# EAGLE design z1-cc1120 (EAGLE 6.5.0)
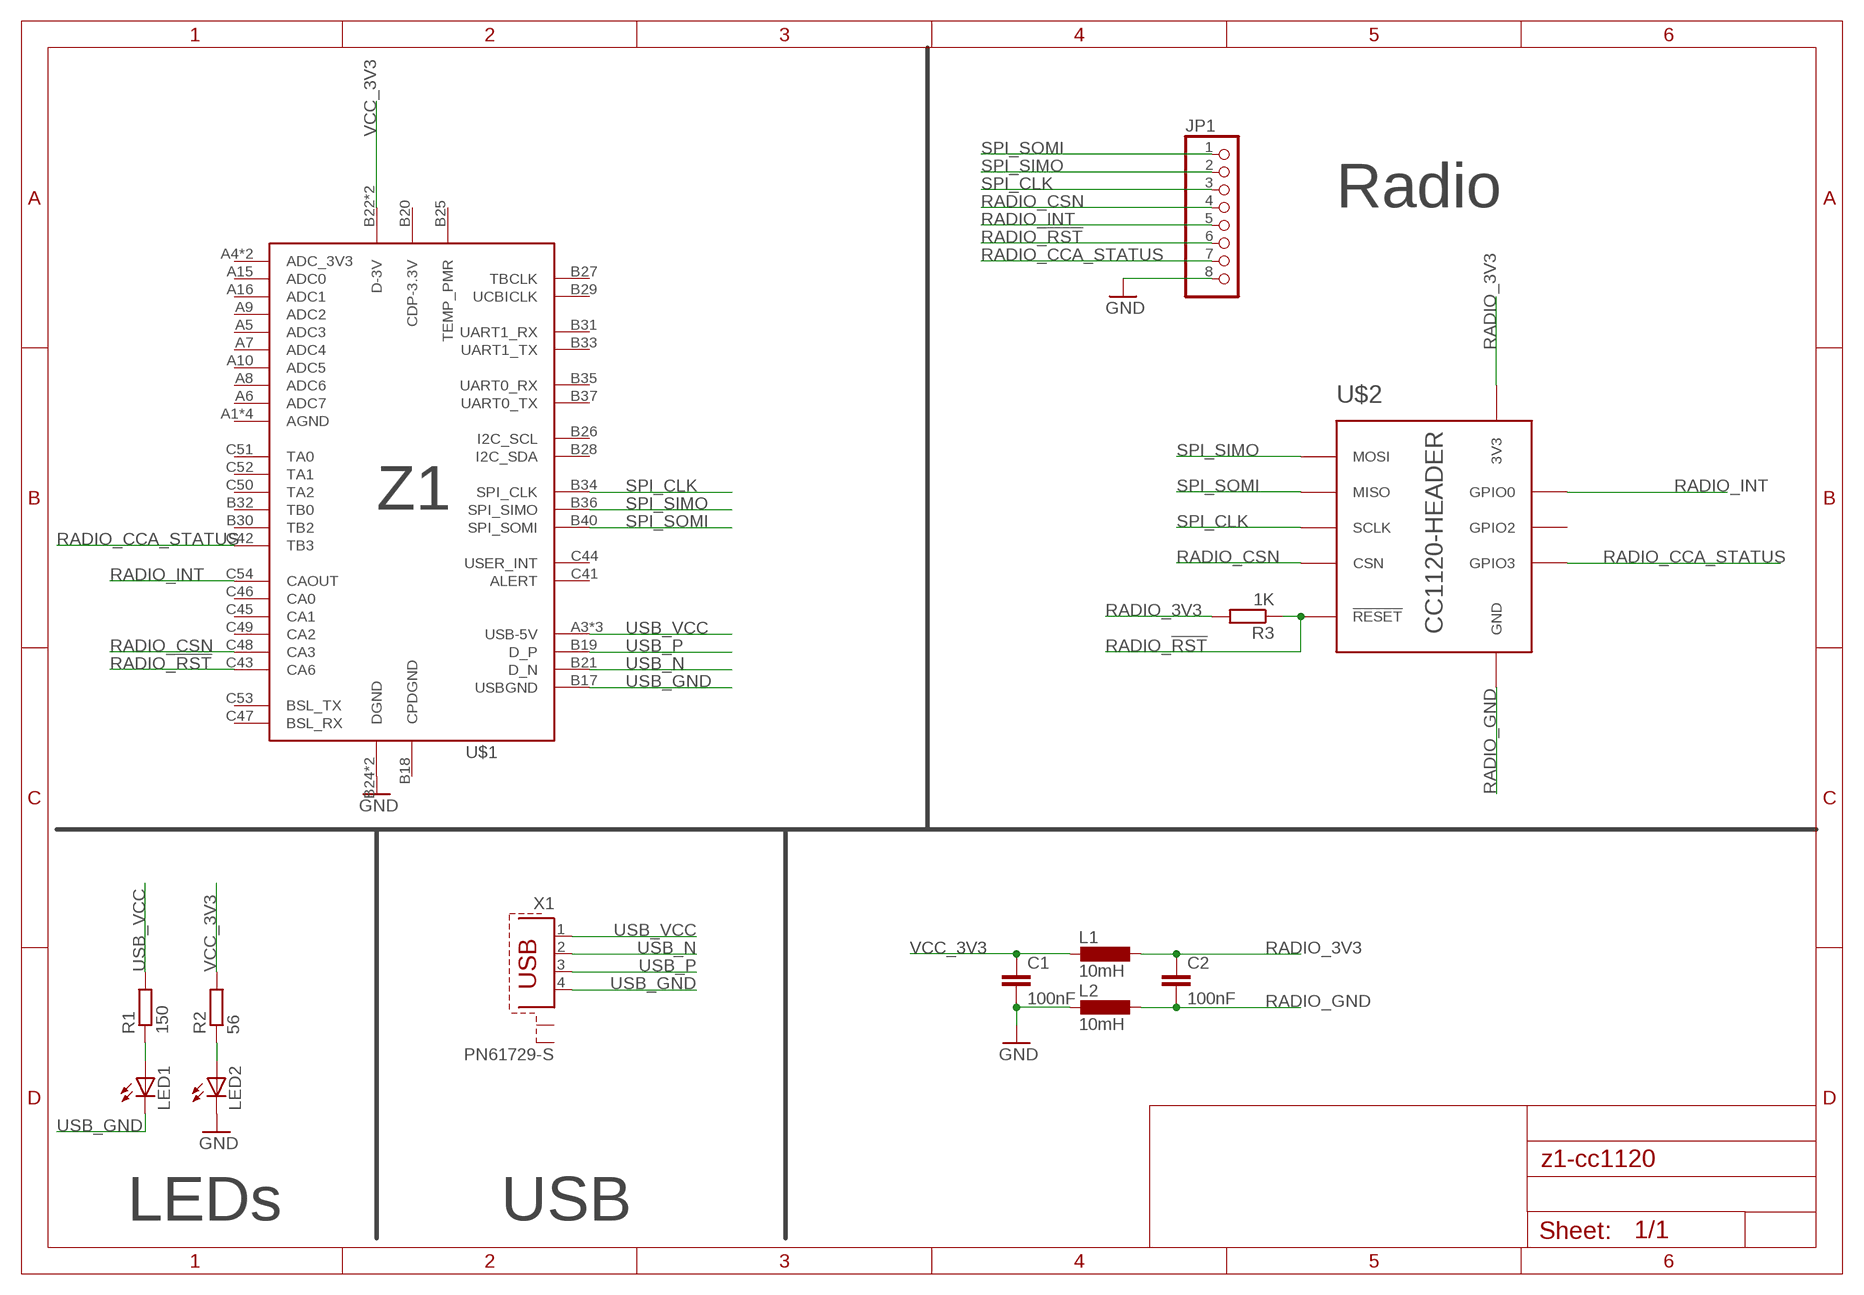
[diagram p0: schematic, sheet 1]

## Parts
C1  100nF  C-EUC0805  [C0805]
C2  100nF  C-EUC0805  [C0805]
JP1  PINHD-1X8  [1X08]
L1  10mH  L-EUL3230M  [L3230M]
L2  10mH  L-EUL3230M  [L3230M]
LED1  LEDCHIP-LED0805  [CHIP-LED0805]
LED2  LEDCHIP-LED0805  [CHIP-LED0805]
R1  150  R-EU_R0805  [R0805]
R2  56  R-EU_R0805  [R0805]
R3  1K  R-EU_R0805  [R0805]
U$1  Z1  [Z1]
U$2  CC1120-HEADER-SMT  [CC1120-HEADERS-SMT]
X1  PN61729-S  [PN61729-S]

## Nets
GND: C1.2 JP1.8 L2.2 LED2.C U$1.B24(DGND) U$1.C39(DGND)
N$24: LED2.A R2.1
N$26: LED1.A R1.1
RADIO_3V3: C2.1 L1.1 R3.2 U$2.3V3-1(3V3) U$2.3V3-2(3V3)
RADIO_!RST: JP1.6 R3.1 U$1.C43(CA6) U$2.RESET(!RESET)
RADIO_CCA_STATUS: JP1.7 U$1.C42(TB3) U$2.GPIO3
RADIO_CSN: JP1.4 U$1.C48(CA3) U$2.CSN
RADIO_GND: C2.2 L2.1 U$2.GND U$2.GND1(GND) U$2.GND2(GND)
RADIO_INT: JP1.5 U$1.C54(CAOUT) U$2.GPIO0
SPI_CLK: JP1.3 U$1.B34(SPI_CLK) U$2.SCLK
SPI_SIMO: JP1.2 U$1.B36(SPI_SIMO) U$2.MOSI
SPI_SOMI: JP1.1 U$1.B40(SPI_SOMI) U$2.MISO
USB_GND: LED1.C U$1.B17(USBGND) X1.4
USB_N [usb]: U$1.B21(D_N) X1.2
USB_P [usb]: U$1.B19(D_P) X1.3
USB_VCC: R1.2 U$1.A3(USB-5V) U$1.A13(USB-5V) U$1.B23(USB-5V) X1.1
VCC_3V3: C1.1 L1.2 R2.2 U$1.B22(D-3V) U$1.C40(D-3V)
Unconnected: U$1.A1(AGND) U$1.A2(AGND) U$1.A5(ADC3) U$1.A6(ADC7) U$1.A7(ADC4) U$1.A8(ADC6) U$1.A9(ADC2) U$1.A10(ADC5) U$1.A11(AGND) U$1.A12(AGND) U$1.A15(ADC0) U$1.A16(ADC1) U$1.B18(CPDGND) U$1.B20(CDP-3.3V) U$1.B25(TEMP_PMR) U$1.B26(I2C_SCL) U$1.B27(TBCLK) U$1.B28(I2C_SDA) U$1.B29(UCBICLK) U$1.B30(TB2) U$1.B31(UART1_RX) U$1.B32(TB0) U$1.B33(UART1_TX) U$1.B35(UART0_RX) U$1.B37(UART0_TX) U$1.C41(ALERT) U$1.C44(USER_INT) U$1.C45(CA1) U$1.C46(CA0) U$1.C47(BSL_RX) U$1.C49(CA2) U$1.C50(TA2) U$1.C51(TA0) U$1.C52(TA1) U$1.C53(BSL_TX) U$2.GPIO2 X1.S1 X1.S2

## Notes on the sheet
- Radio
- LEDs | USB

## Power pins joined to a net without a drawn wire
ADC_3V3: U$1.A4(ADC_3V3) U$1.A14(ADC_3V3)

## Library data of the parts
C1 C2 = resistor:C-EU: CAPACITOR, European symbol
JP1 = pinhead:PINHD-1X8: PIN HEADER
L1 L2 = resistor:L-EU: INDUCTOR, European symbol
LED1 LED2 = led:LED: LED OSRAM: - CHIPLED LG R971, LG N971, LY N971, LG Q971, LY Q971, LO R971, LY R971 LH N974, LH R974 LS Q976, LO Q976, LY Q976 LO Q996 - Hyper CHIPLED LW Q18S LB Q993, LB Q99A, LB R99A - SideLED LS A670, LO A670, LY A670, LG A670, LP A670 LB A673, LV A673, LT A673, LW A673 LH A674 LY A675 LS A676, LA A676, LO A676, LY A676, LW A676 LS A679, LY A679, LG A679 - Hyper Micro SIDELED® LS Y876, LA Y876, LO Y876, LY Y876 LT Y87S - SmartLED LW L88C, LW L88S LB L89C, LB L89S, LG L890 LS L89K, LO L89K, LY L89K LS L896, LA L896, LO L896, LY L896 - TOPLED LS T670, LO T670, LY T670, LG T670, LP T670 LSG T670, LSP T670, LSY T670, LOP T670, LYG T670 LG T671, LOG T671, LSG T671 LB T673, LV T673, LT T673, LW T673 LH T674 LS T676, LA T676, LO T676, LY T676, LB T676, LH T676, LSB T676, LW T676 LB T67C, LV T67C, LT T67C, LS T67K, LO T67K, LY T67K, LW E67C LS E67B, LA E67B, LO E67B, LY E67B, LB E67C, LV E67C, LT E67C LW T67C LS T679, LY T679, LG T679 LS T770, LO T770, LY T770, LG T770, LP T770 LB T773, LV T773, LT T773, LW T773 LH T774 LS E675, LA E675, LY E675, LS T675 LS T776, LA T776, LO T776, LY T776, LB T776 LHGB T686 LT T68C, LB T68C - Hyper Mini TOPLED® LB M676 - Mini TOPLED Santana® LG M470 LS M47K, LO M47K, LY M47K Source: http://www.osram.convergy.de LUXEON: - LUMILED® LXK2-PW12-R00, LXK2-PW12-S00, LXK2-PW14-U00, LXK2-PW14-V00 LXK2-PM12-R00, LXK2-PM12-S00, LXK2-PM14-U00 LXK2-PE12-Q00, LXK2-PE12-R00, LXK2-PE12-S00, LXK2-PE14-T00, LXK2-PE14-U00 LXK2-PB12-K00, LXK2-PB12-L00, LXK2-PB12-M00, LXK2-PB14-N00, LXK2-PB14-P00, LXK2-PB14-Q00 LXK2-PR12-L00, LXK2-PR12-M00, LXK2-PR14-Q00, LXK2-PR14-R00 LXK2-PD12-Q00, LXK2-PD12-R00, LXK2-PD12-S00 LXK2-PH12-R00, LXK2-PH12-S00 LXK2-PL12-P00, LXK2-PL12-Q00, LXK2-PL12-R00 Source: www.luxeon.com KINGBRIGHT: KA-3528ASYC Source: www.kingbright.com
R1-R3 = resistor:R-EU_: RESISTOR, European symbol
U$1 = z1:Z1
U$2 = CC11x:CC1120-HEADER; MANUFACTURER: HARWIN; MPN: M50-3601042; OC_FARNEL: CN14037; QTY: 2
X1 = con-berg:PN61729-S: BERG USB connector; OC_FARNELL: unknown; OC_NEWARK: unknown

## Net classes
1 usb: width 0.305 mm, clearance 0.152 mm

## Board
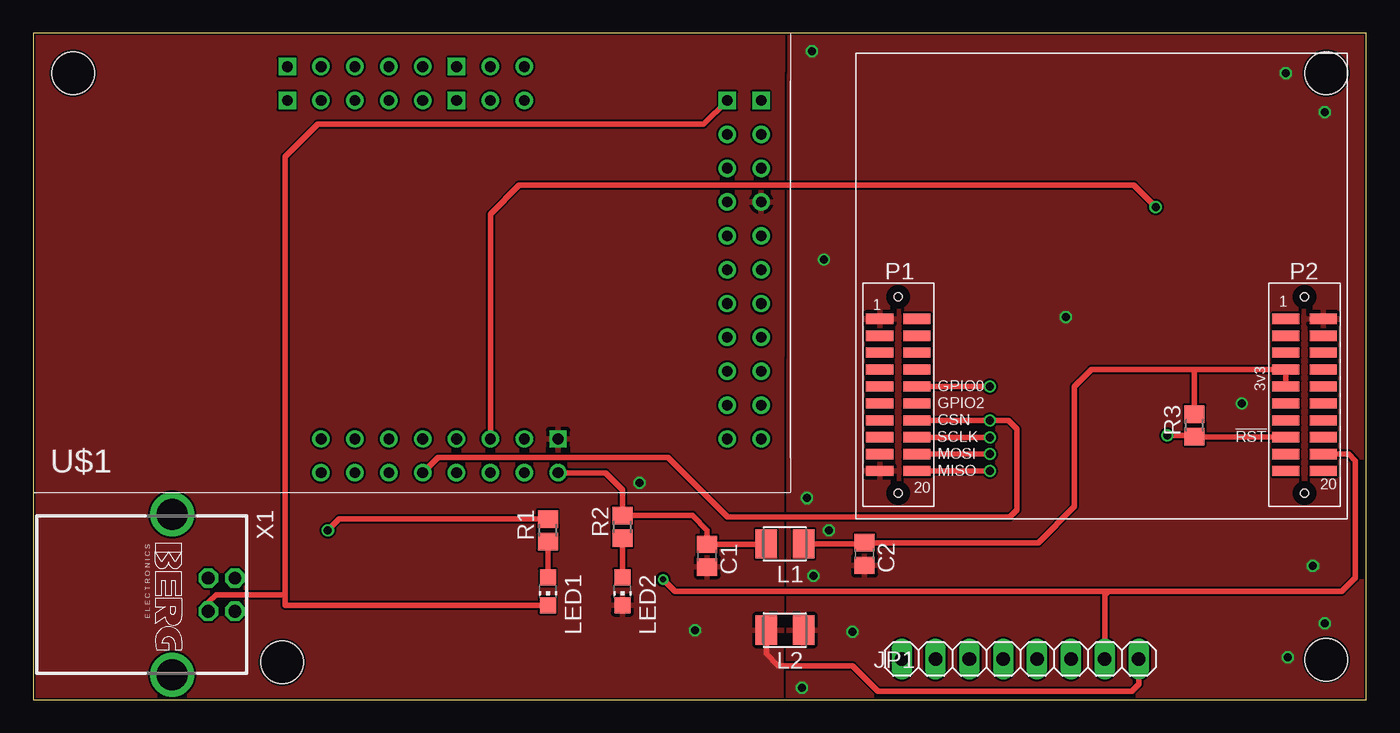
[diagram p1: board, top side]
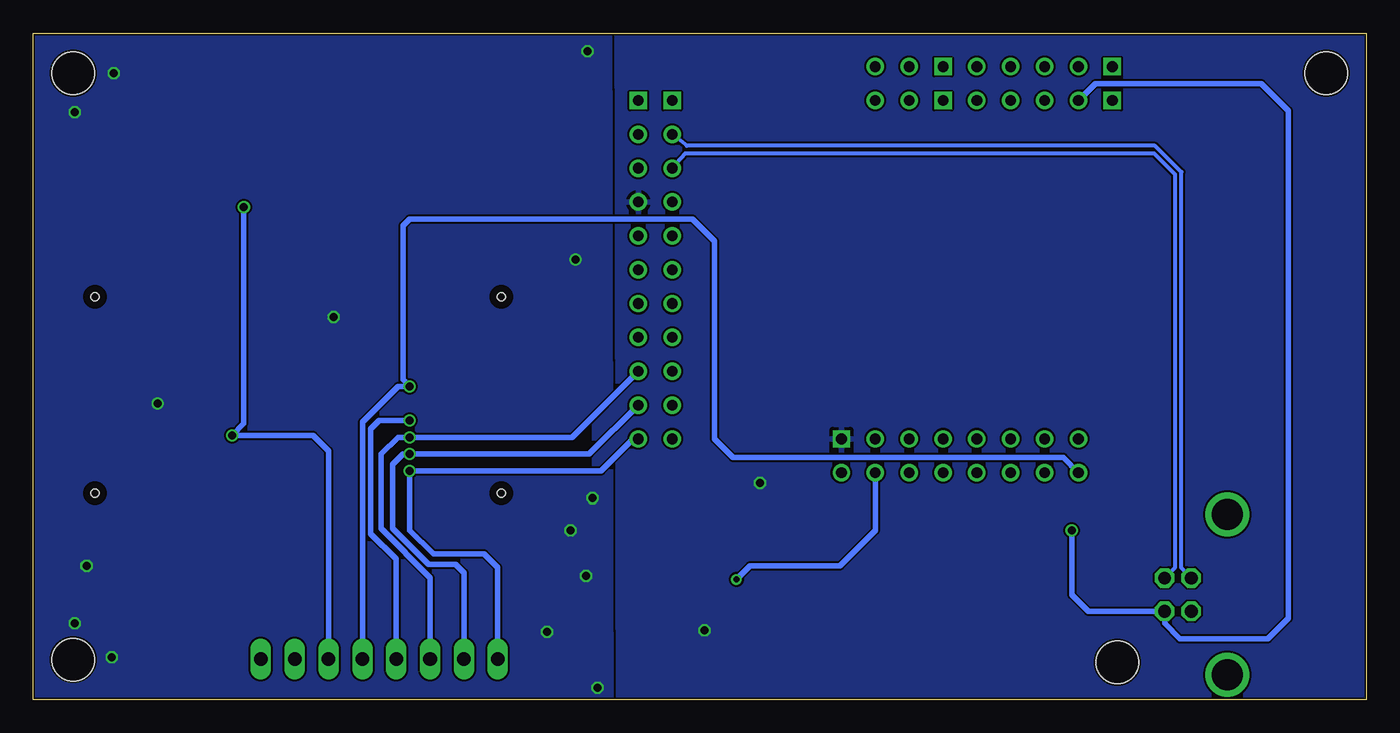
[diagram p2: board, bottom side, seen from below]

Size 100 x 50 mm. Coordinates in mm from the lower left corner, seen from the top.
Outline: 0,0 100,0 100,50 0,50 0,0
Copper layers (1*16): Top 0.035mm / dielectric 1.5mm / Bottom 0.035mm
Design rules "Hackvana *": minimum track width 6mil, minimum drill 0.3mm, track to track 6mil, track to pad 6mil, pad to pad 6mil, via to via 6mil, smd to smd 0mil, copper to edge 6mil, drill to drill 6mil, minimum pad ring 10mil, minimum via ring 6mil, stop-mask expansion 2mil, vias tented up to drill 100mil, thermal gap 10mil
Holes 3.2 mm at 97,3 3,47 97,47 18.67,2.79

### Footprints (pad centres in the part's own frame; a part is rotated, then mirrored left to right if it is on the bottom)
C0805 = smd 1.3 x 1.5: 1 -0.85,0; 2 0.85,0
1X08 = drill 1.016 long: 1 -8.89,0; 2 -6.35,0; 3 -3.81,0; 4 -1.27,0; 5 1.27,0; 6 3.81,0; 7 6.35,0; 8 8.89,0
L3230M = smd 1.6 x 2.2: 1 -1.4,0; 2 1.4,0
CHIP-LED0805 = smd 1.2 x 1.2: A 0,-1.05; C 0,1.05
R0805 = smd 1.3 x 1.5: 1 -0.85,0; 2 0.85,0
Z1 = drill 0.8 square: A1 17.78,-5.08; A2 17.78,-2.54; A11 30.48,-5.08; A12 30.48,-2.54; B17 50.8,-5.08; B18 53.34,-5.08; C39 38.1,-30.48 | drill 0.8: A3 20.32,-5.08; A4 20.32,-2.54; A5 22.86,-5.08; A6 22.86,-2.54; A7 25.4,-5.08; A8 25.4,-2.54; A9 27.94,-5.08; A10 27.94,-2.54; A13 33.02,-5.08; A14 33.02,-2.54; A15 35.56,-5.08; A16 35.56,-2.54; B19 50.8,-7.62; B20 53.34,-7.62; B21 50.8,-10.16; B22 53.34,-10.16; B23 50.8,-12.7; B24 53.34,-12.7; B25 50.8,-15.24; B26 53.34,-15.24; B27 50.8,-17.78; B28 53.34,-17.78; B29 50.8,-20.32; B30 53.34,-20.32; B31 50.8,-22.86; B32 53.34,-22.86; B33 50.8,-25.4; B34 53.34,-25.4; B35 50.8,-27.94; B36 53.34,-27.94; B37 50.8,-30.48; B40 53.34,-30.48; C40 38.1,-33.02; C41 35.56,-30.48; C42 35.56,-33.02; C43 33.02,-30.48; C44 33.02,-33.02; C45 30.48,-30.48; C46 30.48,-33.02; C47 27.94,-30.48; C48 27.94,-33.02; C49 25.4,-30.48; C50 25.4,-33.02; C51 22.86,-30.48; C52 22.86,-33.02; C53 20.32,-30.48; C54 20.32,-33.02
CC1120-HEADERS-SMT = smd 2.032 x 0.762: 3V3-1 13.97,1.905; 3V3-2 13.97,0.635; CSN -13.716,-1.905; GND -16.51,-5.715; GND1 -16.51,5.715; GND2 16.764,5.715; GPIO0 -13.716,0.635; GPIO2 -13.716,-0.635; GPIO3 16.764,-4.445; MISO -13.716,-5.715; MOSI -13.716,-4.445; P$2 -16.51,4.445; P$3 -16.51,3.175; P$4 -16.51,1.905; P$5 -16.51,0.635; P$6 -16.51,-0.635; P$7 -16.51,-1.905; P$8 -16.51,-3.175; P$9 -16.51,-4.445; P$11 -13.716,5.715; P$12 -13.716,4.445; P$13 -13.716,3.175; P$14 -13.716,1.905; P$21 13.97,5.715; P$22 13.97,4.445; P$23 13.97,3.175; P$26 13.97,-0.635; P$27 13.97,-1.905; P$29 13.97,-4.445; P$30 13.97,-5.715; P$32 16.764,4.445; P$33 16.764,3.175; P$34 16.764,1.905; P$35 16.764,0.635; P$36 16.764,-0.635; P$37 16.764,-1.905; P$38 16.764,-3.175; P$40 16.764,-5.715; RESET 13.97,-3.175; SCLK -13.716,-3.175 | hole 0.6: -15.113,7.366; 15.367,7.366; -15.113,-7.366; 15.367,-7.366
PN61729-S = drill 0.95 octagon: 1 1.25,4.71; 2 -1.25,4.71; 3 -1.25,2.71; 4 1.25,2.71 | drill 2.3 pad 2.9: S1 -6.02,0; S2 6.02,0

### Placement (x,y rotation side)
C1  50.55,10.79 270 top
C2  62.36,10.92 270 top
JP1  74.04,3.05 0 top
L1  56.39,11.68 180 top
L2  56.39,5.21 180 top
LED1  38.61,8.13 180 top
LED2  44.2,8.13 180 top
R1  38.61,12.7 90 top
R2  44.2,12.95 90 top
R3  87.12,20.57 90 top
U$1  1.27,50.04 0 top
U$2  80.01,22.86 0 top
X1  10.41,7.87 270 top

### Tracks (layer width: path | path; a pad name or v marks a point on that pad's centre or on a via)
GND  (via drill 0.6)
  Top 0.406: L2.2 54.99,3.43 55.88,2.54 61.47,2.54 63.37,0.64 82.42,0.64 82.93,1.14 JP1.8
  other vias: 45.47,16.26 49.66,5.21
  pour Bottom (rank 2): -1.65,52.7 -1.65,-1.78 57.91,-1.91 57.91,52.45
  pour Top (rank 2): -3.43,54.23 -3.43,-3.17 59.44,-3.05 59.44,54.36
N$24
  Top 0.406: R2.1 LED2.A
N$26
  Top 0.406: R1.1 LED1.A
RADIO_3V3
  Top 0.406: U$2.3V3-2 U$2.3V3-1 87.12,24.77 | L1.1 62.27,11.68 C2.1 75.4,11.77 78.11,14.48 78.11,23.5 79.38,24.77 87.12,24.77 | R3.2 87.12,24.77
RADIO_!RST  (via drill 0.6)
  Top 0.406: U$1.C43 34.29,36.45 36.45,38.61 82.55,38.61 v84.2,36.96 | v85.09,19.81 87.03,19.81 87.03,19.72 R3.1 93.98,19.72 U$2.RESET
  Bottom 0.406: v84.2,36.96 84.2,20.7 v85.09,19.81 78.99,19.81 77.85,18.67 JP1.6
RADIO_CCA_STATUS  (via drill 0.48)
  Top 0.406: U$2.GPIO3 98.68,18.41 99.19,17.91 99.19,9.14 98.17,8.13 80.64,8.13 | 80.64,8.13 48.13,8.13 v47.24,9.02 | JP1.7 80.39,7.87 80.64,8.13
  Bottom 0.406: v47.24,9.02 46.23,10.03 39.5,10.03 36.83,12.7 U$1.C42
RADIO_CSN  (via drill 0.6)
  Top 0.406: U$2.CSN v71.75,20.95 73.15,20.95 73.79,20.32 73.79,14.22 73.28,13.72 52.07,13.72 47.62,18.16 30.35,18.16 U$1.C48
  Bottom 0.406: JP1.4 72.77,10.54 74.68,12.45 74.68,20.32 74.04,20.95 v71.75,20.95
RADIO_GND  (via drill 0.6)
  other vias: 57.66,0.89 58.42,48.64 96.9,44.07 93.98,46.99 94.11,3.17 96.9,5.71 59.31,33.02 90.68,22.23 61.47,5.08 96.01,10.03 58.55,9.27 58.04,15.11 59.69,12.7 77.47,28.7
  pour Top: 103.5,57.66 103.5,-6.48 56.64,-6.48 56.77,57.66
  pour Bottom: 101.73,55.75 101.6,-5.08 56.64,-5.08 56.77,55.88
RADIO_INT  (via drill 0.6)
  Top 0.406: v71.75,23.5 U$2.GPIO0
  Bottom 0.406: JP1.5 75.31,20.83 72.64,23.5 v71.75,23.5 72.26,24 72.26,35.56 71.75,36.07 50.55,36.07 48.9,34.42 48.9,19.56 47.5,18.16 22.73,18.16 U$1.C54
SPI_CLK  (via drill 0.6)
  Top 0.406: v71.75,19.68 U$2.SCLK
  Bottom 0.406: U$1.B34 59.56,19.68 v71.75,19.68 72.64,19.68 73.91,18.41 73.91,12.83 70.23,9.14 JP1.3
SPI_SIMO  (via drill 0.6)
  Top 0.406: v71.75,18.41 U$2.MOSI
  Bottom 0.406: U$1.B36 58.29,18.41 v71.75,18.41 72.26,18.41 73.03,17.65 73.03,12.83 70.36,10.16 68.33,10.16 67.69,9.53 JP1.2
SPI_SOMI  (via drill 0.6)
  Top 0.406: v71.75,17.14 U$2.MISO
  Bottom 0.406: U$1.B40 54.99,19.56 57.4,17.14 v71.75,17.14 71.75,12.7 69.98,10.92 66.17,10.92 65.15,9.91 JP1.1
USB_GND
  Top 0.406: U$1.B17 50.29,43.18 21.34,43.18 18.89,40.74 18.89,7.87 | 18.89,7.87 18.89,7.08 LED1.C | X1.4 13.12,7.28 13.72,7.87 18.89,7.87
USB_N
  Bottom 0.305: X1.2 14.33,9.92 14.33,39.4 15.91,40.99 51.09,40.99 U$1.B21
USB_P
  Bottom 0.305: X1.3 13.87,9.87 13.87,39.59 15.84,41.56 50.96,41.56 U$1.B19
USB_VCC  (via drill 0.6)
  Top 0.406: R1.2 22.95,13.55 v22.1,12.7
  Bottom 0.406: U$1.A3 20.32,46.23 7.87,46.23 5.84,44.2 5.84,6.1 7.37,4.57 13.97,4.57 15.12,5.73 X1.1 15.14,6.6 20.83,6.6 22.1,7.87 v22.1,12.7
VCC_3V3
  Top 0.406: U$1.C40 42.93,17.02 44.2,15.75 R2.2 49.44,13.8 50.55,12.7 C1.1 54.95,11.64 L1.2

### Text on the board
tDocu: Z1 - CC1120 Interface | Mountain Sensing | Version 0.2 | PJB